# EAGLE design STK-681-332-E EvalBoard OwnRoutingStarted (EAGLE 9.3.1)

## Sheet 1 of 4: Supply, Reverse Voltage Protection, Power Indicators
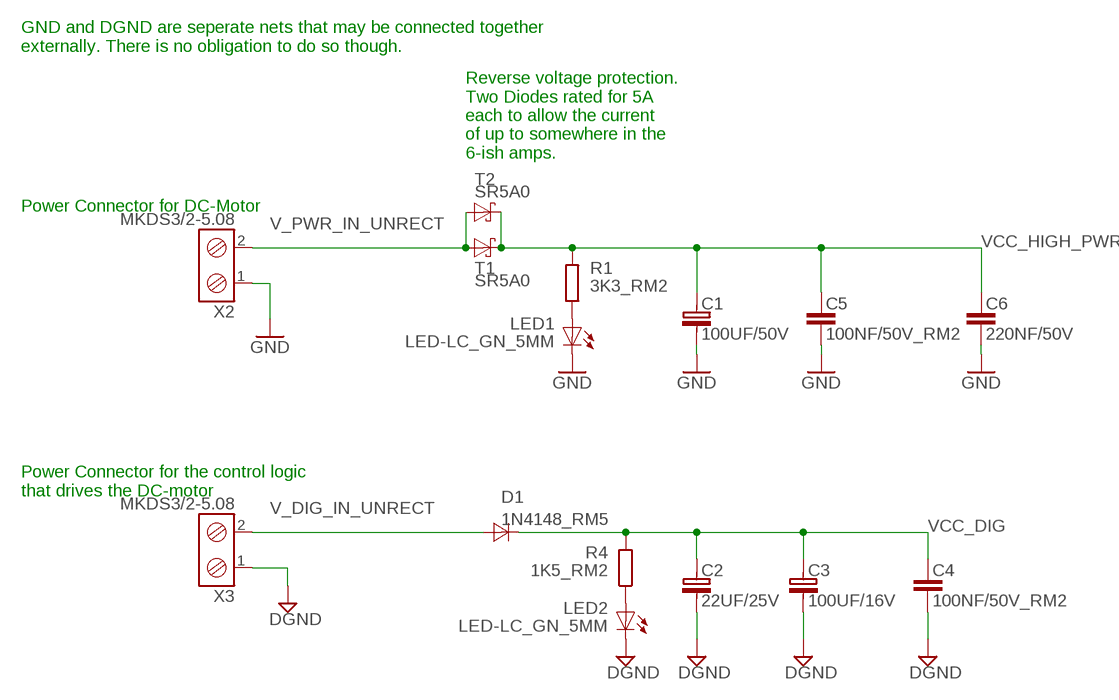
[diagram p0: schematic, sheet 1]

### Parts
C1  100UF/50V  [RM3,5D8]
C2  22UF/25V  [RM2D5]
C3  100UF/16V  [RM2,5D6]
C4  100NF/50V_RM2  [RM2.54]
C5  100NF/50V_RM2  [RM2.54]
C6  220NF/50V  [RM2.54]
D1  1N4148_RM5  [DO35_RM5.08]
LED1  LED-LC_GN_5MM  [LED5MM]
LED2  LED-LC_GN_5MM  [LED5MM]
R1  3K3_RM2  [RM2.54]
R4  1K5_RM2  [RM2.54]
T1  SR5A0  [DO201_RM10.16]
T2  SR5A0  [DO201_RM10.16]
X2  MKDS3/2-5.08  [MKDS3/2-5.08]
X3  MKDS3/2-5.08  [MKDS3/2-5.08]

### Nets
DGND: C2.- C3.- C4.2 LED2.K(C) X3.1 ; also sheet 2,3,4
GND: C1.- C5.2 C6.2 LED1.K(C) X2.1 ; also sheet 4
N$5: LED1.A R1.1
N$7: LED2.A R4.1
V_DIG_IN_UNRECT: D1.A X3.2
V_PWR_IN_UNRECT: T1.A T2.A X2.2
VCC_DIG: C2.+ C3.+ C4.1 D1.K R4.2 ; also sheet 2,3,4
VCC_HIGH_PWR: C1.+ C5.1 C6.1 R1.2 T1.K T2.K ; also sheet 4

### Notes on the sheet
- GND and DGND are seperate nets that may be connected together  
  externally. There is no obligation to do so though.
- Reverse voltage protection.
  Two Diodes rated for 5A
  each to allow the current 
  of up to somewhere in the 
  6-ish amps.
- Power Connector for DC-Motor
- Power Connector for the control logic
  that drives the DC-motor

## Sheet 2 of 4: Direction Signal Decoding, Brake
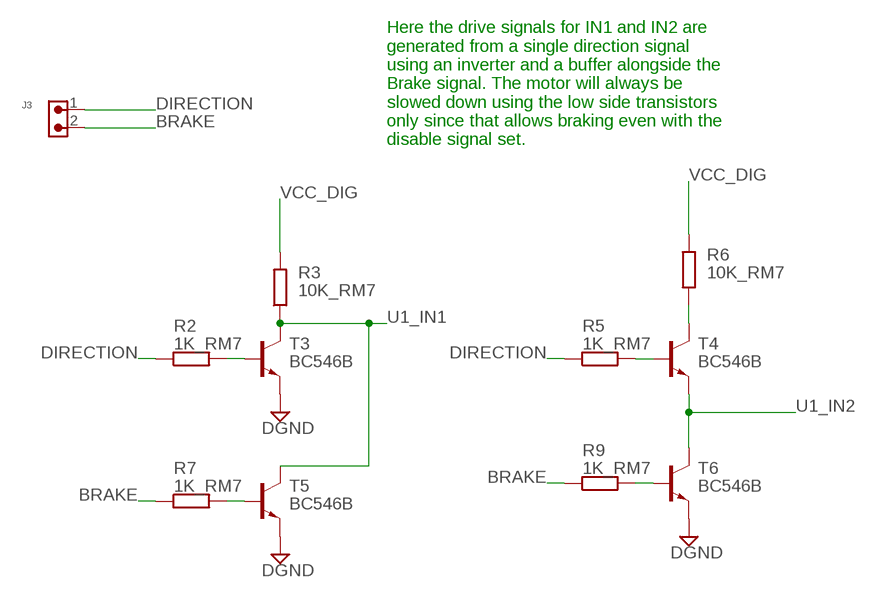
[diagram p1: schematic, sheet 2]

### Parts
J3  6130XX11121_61300211121  [61300211121]
R2  1K_RM7  [RM7.62]
R3  10K_RM7  [RM7.62]
R5  1K_RM7  [RM7.62]
R6  10K_RM7  [RM7.62]
R7  1K_RM7  [RM7.62]
R9  1K_RM7  [RM7.62]
T3  BC546B  [TO92]
T4  BC546B  [TO92]
T5  BC546B  [TO92]
T6  BC546B  [TO92]

### Nets
BRAKE: J3.2 R7.1 R9.1
DGND: T3.3(E) T5.3(E) T6.3(E) ; also sheet 1,3,4
DIRECTION: J3.1 R2.1 R5.1
N$3: R2.2 T3.2(B)
N$4: R5.2 T4.2(B)
N$6: R6.1 T4.1(C)
N$8: R7.2 T5.2(B)
N$9: R9.2 T6.2(B)
U1_IN1: R3.1 T3.1(C) T5.1(C) ; also sheet 4
U1_IN2: T4.3(E) T6.1(C) ; also sheet 4
VCC_DIG: R3.2 R6.2 ; also sheet 1,3,4

### Notes on the sheet
- Here the drive signals for IN1 and IN2 are
  generated from a single direction signal 
  using an inverter and a buffer alongside the 
  Brake signal. The motor will always be
  slowed down using the low side transistors
  only since that allows braking even with the
  disable signal set.

## Sheet 3 of 4: Disable and PWM
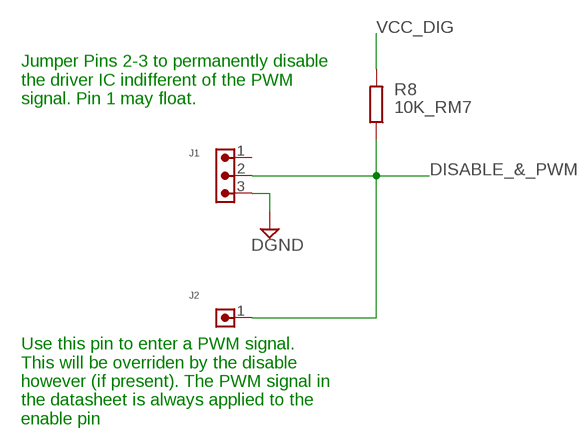
[diagram p2: schematic, sheet 3]

### Parts
J1  6130XX11121_61300311121  [61300311121]
J2  6130XX11121_61300111121  [61300111121]
R8  10K_RM7  [RM7.62]

### Nets
DGND: J1.3 ; also sheet 1,2,4
DISABLE_&_PWM: J1.2 J2.1 R8.1 ; also sheet 4
VCC_DIG: R8.2 ; also sheet 1,2,4
Unconnected: J1.1

### Notes on the sheet
- Jumper Pins 2-3 to permanently disable 
  the driver IC indifferent of the PWM 
  signal. Pin 1 may float.
- Use this pin to enter a PWM signal.
  This will be overriden by the disable 
  however (if present). The PWM signal in
  the datasheet is always applied to the 
  enable pin

## Sheet 4 of 4: Hook up of the actual IC itself
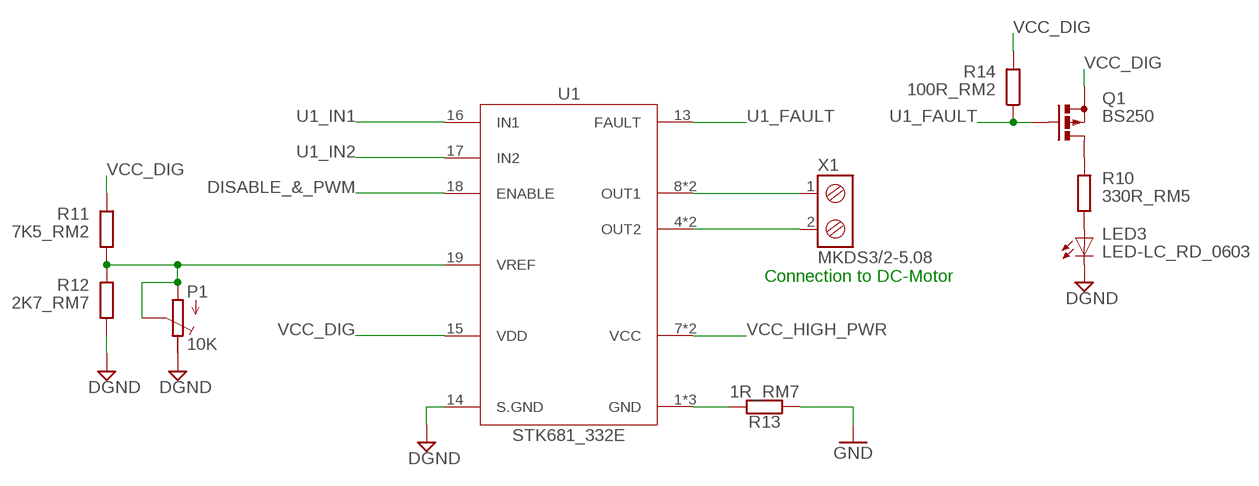
[diagram p3: schematic, sheet 4]

### Parts
LED3  LED-LC_RD_0603  [0603]
P1  10K  [R_TRIMM]
Q1  BS250  [SOT54E]
R10  330R_RM5  [RM5.08]
R11  7K5_RM2  [RM2.54]
R12  2K7_RM7  [RM7.62]
R13  1R_RM7  [RM7.62]
R14  100R_RM2  [RM2.54]
U1  STK681_332E  [SIP19]
X1  MKDS3/2-5.08  [MKDS3/2-5.08]

### Nets
DGND: LED3.K(C) P1.3(E) R12.1 U1.14(S.GND) ; also sheet 1,2,3
DISABLE_&_PWM: U1.18(ENABLE) ; also sheet 3
GND: R13.1 ; also sheet 1
N$1: U1.8(OUT1) U1.10(OUT1) X1.1
N$2: U1.4(OUT2) U1.6(OUT2) X1.2
N$10: LED3.A R10.1
N$11: Q1.D R10.2
N$12: R13.2 U1.1(GND) U1.2(GND) U1.3(GND)
N$13: P1.1(A) P1.2(S) R11.1 R12.2 U1.19(VREF)
U1_FAULT: Q1.G R14.1 U1.13(FAULT)
U1_IN1: U1.16(IN1) ; also sheet 2
U1_IN2: U1.17(IN2) ; also sheet 2
VCC_DIG: Q1.S R11.2 R14.2 U1.15(VDD) ; also sheet 1,2,3
VCC_HIGH_PWR: U1.7(VCC) U1.9(VCC) ; also sheet 1
Unconnected: U1.5(NC) U1.11(NC) U1.12(NC)

### Notes on the sheet
- Connection to DC-Motor

## Library data of the parts
C1 = ELKO_THD:100UF/50V: 100µF/50V LowESR-Elko, THD; ID: EKO-ELT-0002; REICHELT: RAD FR 100/50; TYPE: THD
C2 = ELKO_THD:22UF/25V: 22µF/25V LowESR-Elko, THD; ID: EKO-ELT-0004; REICHELT: RAD FC 22/25; TYPE: THD
C3 = ELKO_THD:100UF/16V: 100µF/16V LowESR-Elko, THD; ID: EKO-ELT-0001; REICHELT: RAD FC 100/16; TYPE: THD
C4 C5 = Kondensator_Keramik_THD:100NF/50V: 100nF/50V X7R-Kondensator, THD; ID: EKO-KET-0001; REICHELT: X7R-2,5 100N; TYPE: THD
C6 = Kondensator_Keramik_THD:220NF/50V: 220nF/50V Z5U-Kondensator, THD; ID: EKO-KET-0010; REICHELT: Z5U-2,5 220N; TYPE: THD
D1 = Diode:1N4148: 1N4148 (Kleinsignaldiode); ID: EHL-DIO-0001; REICHELT: 1N 4148; TYPE: THD
J1 = Wurth_Connectors_WR-PHD:6130XX11121_61300311121: WR-PHD 2.54 mm THT Pin Header ARTICLE PROPERTIES: Pins:1;​ 2;​ 3;​ 4;​ 5;​ 6;​ 7;​ 8;​ 9;​ 10;​ 12;​ 13;​ 14;​ 15;​ 16;​ 18;​ 20;​ 22;​ 24;​ 25;​ 32;​ 36;​ 40 KIND PROPERTIES: Pitch：2.54 mm Quality Class:3 as per CECC 75 301-802 Rows：Single Gender：Pin Header Type：Straight MATERIAL PROPERTIES: Insulator Material :PBT Insulator Flammability Rating:UL94 V-0 Contact Material:Copper Alloy Contact Plating:Gold Contact Type:Stamped GENERAL INFORMATION Operating Temperature:-40 up to +105 °C Compliance:RoHS ELECTRICAL PROPERTIES: Rated Current:3 A IR 1:3 A Withstanding Voltage:500 V (AC) Contact Resistance:20 mΩ RISO:1000 MΩ CERTIFICATION UL Approval:E323964 PACKAGING PROPERTIES Packaging:Bag <https://katalog.we-online.com/media/images/v2/o33211v209%20Family_BTB_PHD_6130xx11121.jpg> Details see: https://katalog.we-online.com/en/em/PHD_2_54_THT_PIN_HEADER_6130XX11121 Updated by Yingchun,Shan 2019-10-16 2019 (C) Würth Elektronik; DATASHEET-URL: https://katalog.we-online.com/em/datasheet/61300311121.pdf; GENDER: Pin Header; IR: 3A; MATES: WR-PHD 2.54mm Angled Socket Header /SMT Socket Header/Socket Header; PACKAGING: Bag; PART-NUMBER: 61300311121; PINS: 3; ROWS: Single; TYPE: Straight
J2 = Wurth_Connectors_WR-PHD:6130XX11121_61300111121: WR-PHD 2.54 mm THT Pin Header ARTICLE PROPERTIES: Pins:1;​ 2;​ 3;​ 4;​ 5;​ 6;​ 7;​ 8;​ 9;​ 10;​ 12;​ 13;​ 14;​ 15;​ 16;​ 18;​ 20;​ 22;​ 24;​ 25;​ 32;​ 36;​ 40 KIND PROPERTIES: Pitch：2.54 mm Quality Class:3 as per CECC 75 301-802 Rows：Single Gender：Pin Header Type：Straight MATERIAL PROPERTIES: Insulator Material :PBT Insulator Flammability Rating:UL94 V-0 Contact Material:Copper Alloy Contact Plating:Gold Contact Type:Stamped GENERAL INFORMATION Operating Temperature:-40 up to +105 °C Compliance:RoHS ELECTRICAL PROPERTIES: Rated Current:3 A IR 1:3 A Withstanding Voltage:500 V (AC) Contact Resistance:20 mΩ RISO:1000 MΩ CERTIFICATION UL Approval:E323964 PACKAGING PROPERTIES Packaging:Bag <https://katalog.we-online.com/media/images/v2/o33211v209%20Family_BTB_PHD_6130xx11121.jpg> Details see: https://katalog.we-online.com/en/em/PHD_2_54_THT_PIN_HEADER_6130XX11121 Updated by Yingchun,Shan 2019-10-16 2019 (C) Würth Elektronik; DATASHEET-URL: https://katalog.we-online.com/em/datasheet/61300111121.pdf; GENDER: Pin Header; IR: 3A; MATES: WR-PHD 2.54mm Angled Socket Header /SMT Socket Header/Socket Header; PACKAGING: Bag; PART-NUMBER: 61300111121; PINS: 1; ROWS: Single; TYPE: Straight
J3 = Wurth_Connectors_WR-PHD:6130XX11121_61300211121: WR-PHD 2.54 mm THT Pin Header ARTICLE PROPERTIES: Pins:1;​ 2;​ 3;​ 4;​ 5;​ 6;​ 7;​ 8;​ 9;​ 10;​ 12;​ 13;​ 14;​ 15;​ 16;​ 18;​ 20;​ 22;​ 24;​ 25;​ 32;​ 36;​ 40 KIND PROPERTIES: Pitch：2.54 mm Quality Class:3 as per CECC 75 301-802 Rows：Single Gender：Pin Header Type：Straight MATERIAL PROPERTIES: Insulator Material :PBT Insulator Flammability Rating:UL94 V-0 Contact Material:Copper Alloy Contact Plating:Gold Contact Type:Stamped GENERAL INFORMATION Operating Temperature:-40 up to +105 °C Compliance:RoHS ELECTRICAL PROPERTIES: Rated Current:3 A IR 1:3 A Withstanding Voltage:500 V (AC) Contact Resistance:20 mΩ RISO:1000 MΩ CERTIFICATION UL Approval:E323964 PACKAGING PROPERTIES Packaging:Bag <https://katalog.we-online.com/media/images/v2/o33211v209%20Family_BTB_PHD_6130xx11121.jpg> Details see: https://katalog.we-online.com/en/em/PHD_2_54_THT_PIN_HEADER_6130XX11121 Updated by Yingchun,Shan 2019-10-16 2019 (C) Würth Elektronik; DATASHEET-URL: https://katalog.we-online.com/em/datasheet/61300211121.pdf; GENDER: Pin Header; IR: 3A; MATES: WR-PHD 2.54mm Angled Socket Header /SMT Socket Header/Socket Header; PACKAGING: Bag; PART-NUMBER: 61300211121; PINS: 2; ROWS: Single; TYPE: Straight
LED1 LED2 = Optisch:LED-LC_GN: Low-current-LED grün; ID: EOP-LED-0001; REICHELT: LED 5MM 2MA GN; TYPE: THD
LED3 = Optisch:LED-LC_RD: Low-Current-LED rot; ID: EOP-LED-0007; REICHELT: OSO LSL29K-G1J2; TYPE: SMD
P1 = Widerstand_var:10K: 10kΩ Trimmer; ID: EWI-POT-0001; REICHELT: 64W-10K; TYPE: THD
Q1 = transistor-small-signal:BS250: P-CHANNEL MOS FET
R1 = Widerstand_0207:3K3: 3,3kΩ Widerstand, THD 0207; ID: EWI-THD-3301; REICHELT: METALL 3,30K; TYPE: THD
R2 R5 R7 R9 = Widerstand_0207:1K: 1kΩ Widerstand, THD 0207; ID: EWI-THD-1001; REICHELT: METALL 1,00K; TYPE: THD
R3 R6 R8 = Widerstand_0207:10K: 10kΩ Widerstand, THD 0207; ID: EWI-THD-1002; REICHELT: METALL 10,0K; TYPE: THD
R4 = Widerstand_0207:1K5: 1,5kΩ Widerstand, THD 0207; ID: EWI-THD-1501; REICHELT: METALL 1,50K; TYPE: THD
R10 = Widerstand_0207:330R: 330Ω Widerstand, THD 0207; ID: EWI-THD-3300; REICHELT: METALL 330; TYPE: THD
R11 = Widerstand_0207:7K5: 7,5kΩ Widerstand, THD 0207; ID: EWI-THD-7501; REICHELT: METALL 7,50K; TYPE: THD
R12 = Widerstand_0207:2K7: 2,7kΩ Widerstand, THD 0207; ID: EWI-THD-2701; REICHELT: METALL 2,70K; TYPE: THD
R13 = Widerstand_0207:1R: 1Ω Widerstand, THD 0207; ID: EWI-THD-1008; REICHELT: METALL 1,00; TYPE: THD
R14 = Widerstand_0207:100R: 100Ω Widerstand, THD 0207; ID: EWI-THD-1000; REICHELT: METALL 100; TYPE: THD
T1 T2 = Diode:SR5A0: SR5A0 (Schottky-Diode); ID: EHL-DIO-0003; REICHELT: SB 5100; TYPE: THD
T3-T6 = Transistor:BC546B: BC546 (NPN-Transistor); ID: EHL-TRA-0001; REICHELT: BC 546B; TYPE: THD
U1 = Analog:STK681_332E: STK681-332-E (DC Motor Driver); FARNELL: 2217062; ID: EIC-ANA-0014; MOUSER: 863-STK681-332-E; TYPE: THD
X1-X3 = Klemmen:MKDS3/2-5.08: Schraubklemme 2-fach, Liftsystem RM 5,08; FARNELL: 3041165; ID: EKL-PCB-0004; TYPE: THD

## Board
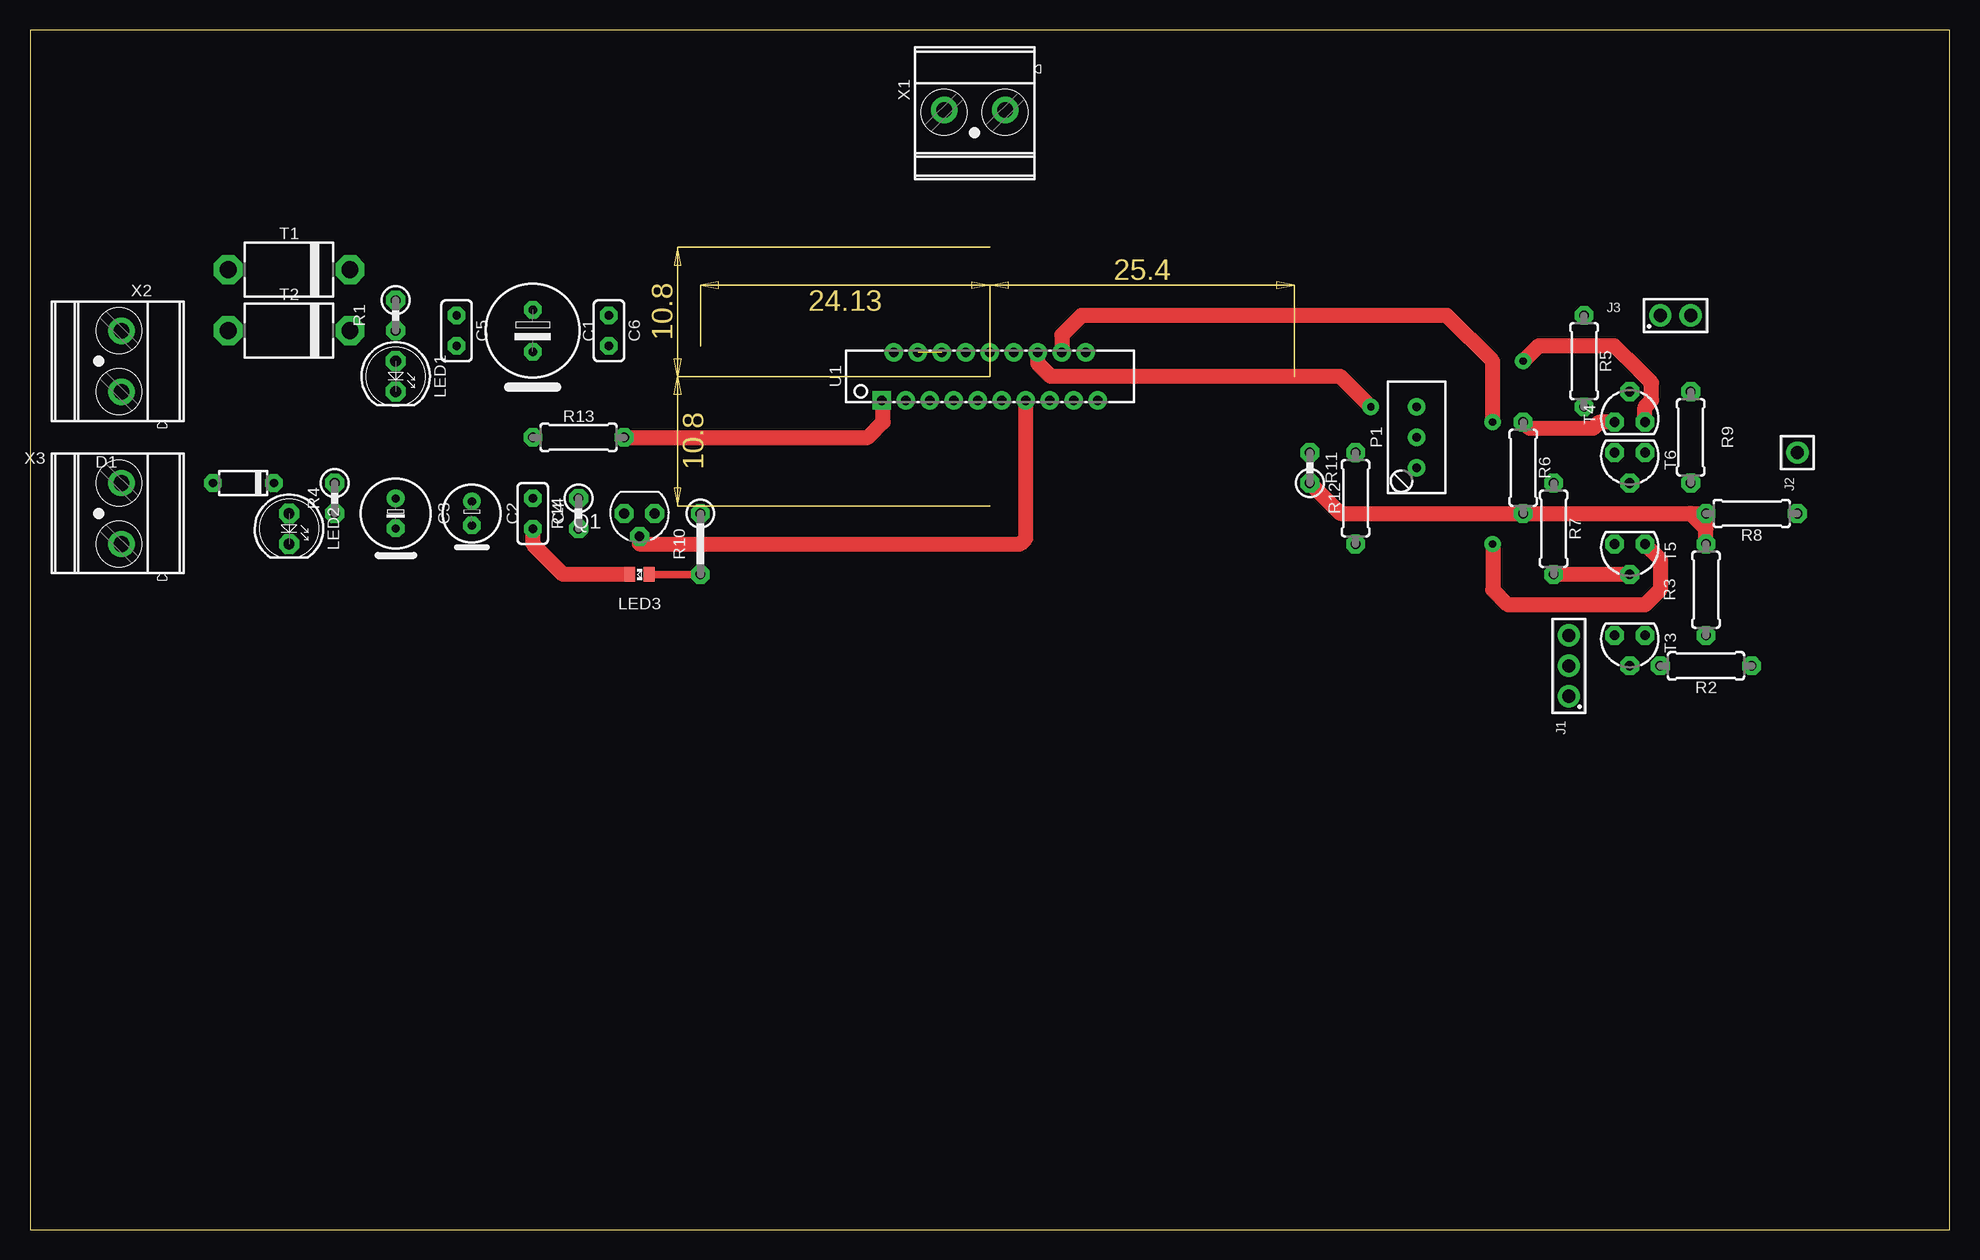
[diagram p4: board, top side]
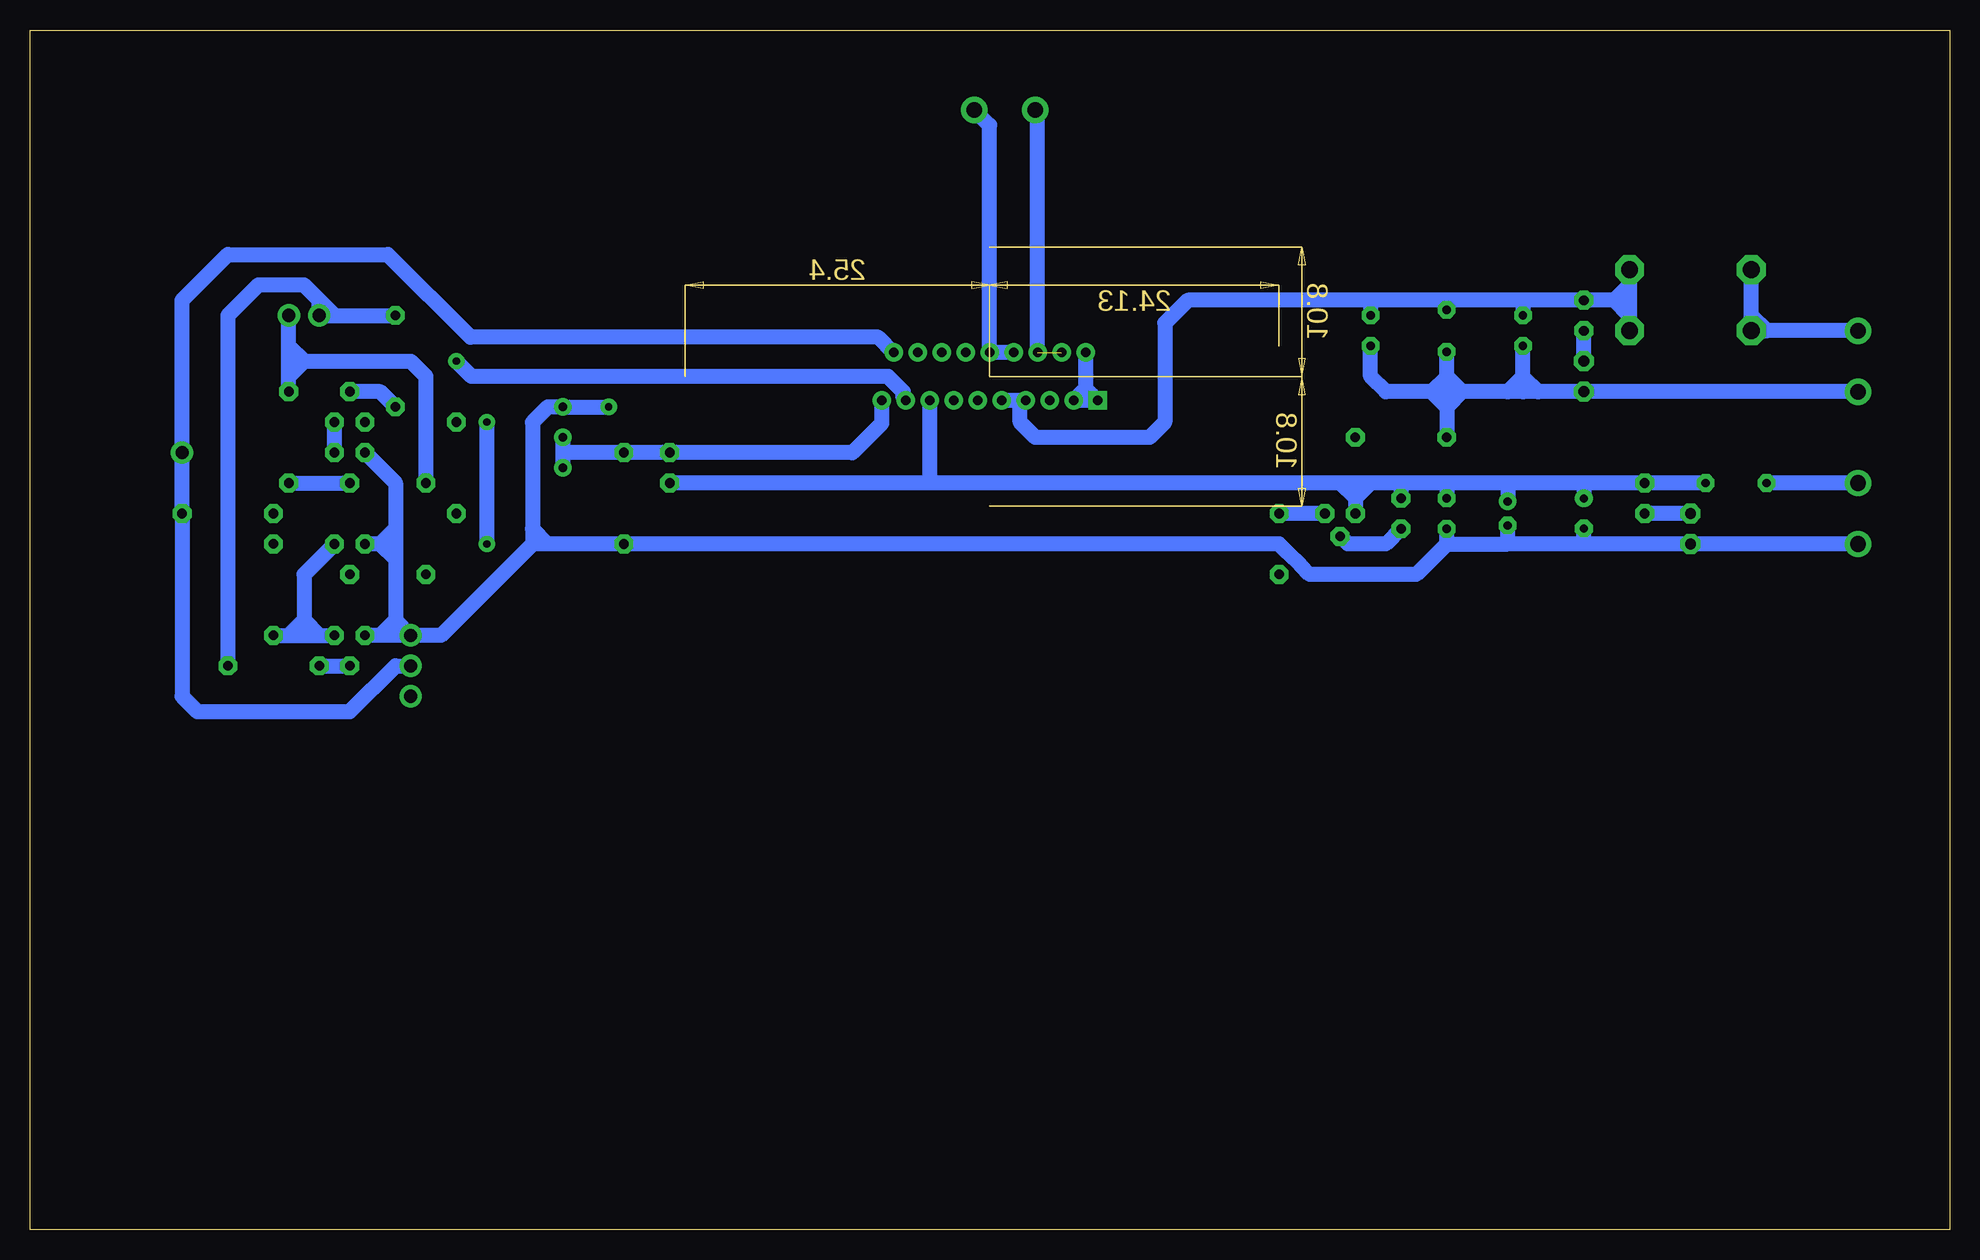
[diagram p5: board, bottom side, seen from below]

Size 160 x 100 mm. Coordinates in mm from the lower left corner, seen from the top.
Outline: 0,0 160,0 160,100 0,100 0,0
Copper layers (1*16): Top 0.035mm / dielectric 1.5mm / Bottom 0.035mm
Design rules "2LayersINT": minimum track width 0.3mm, minimum drill 0.6mm, track to track 15mil, track to pad 15mil, pad to pad 15mil, via to via 15mil, smd to smd 15mil, copper to edge 15mil, drill to drill 0.5mm, minimum pad ring 15mil, minimum via ring 15mil, stop-mask expansion 0mil, vias tented up to drill 100mm, thermal gap 15mil

### Footprints (pad centres in the part's own frame; a part is rotated, then mirrored left to right if it is on the bottom)
RM3,5D8 = drill 0.7 pad 1.3 octagon: + -1.75,0; - 1.75,0
RM2D5 = drill 0.7 pad 1.3: + -1,0 | drill 0.7 pad 1.3 octagon: - 1,0
RM2,5D6 = drill 0.7 pad 1.3: + -1.25,0 | drill 0.7 pad 1.3 octagon: - 1.25,0
RM2.54 = drill 0.7 pad 1.3 octagon: 1 -1.27,0; 2 1.27,0
DO35_RM5.08 = drill 0.7 pad 1.3 octagon: A -2.54,0; K 2.54,0
61300311121 = drill 1.1: 1 -2.54,0; 2 0,0; 3 2.54,0
61300111121 = drill 1.1: 1 0,0
61300211121 = drill 1.1: 1 -1.27,0; 2 1.27,0
LED5MM = drill 0.9 pad 1.5 octagon: A -1.27,0; K 1.27,0
0603 = smd 0.9 x 1.2: A -0.8,0; K 0.8,0
R_TRIMM = drill 0.7 pad 1.3: 1 -2.54,0; 2 0,0; 3 2.54,0
SOT54E = drill 0.813 octagon: D -1.27,0; G 0,1.905; S 1.27,0
RM2.54' = drill 0.8 pad 1.4 octagon: 1 -1.27,0; 2 1.27,0
RM7.62 = drill 0.8 pad 1.4 octagon: 1 -3.81,0; 2 3.81,0
RM5.08 = drill 0.8 pad 1.4 octagon: 1 -2.54,0; 2 2.54,0
DO201_RM10.16 = drill 1.4 pad 2.4 octagon: A -5.08,0; K 5.08,0
TO92 = drill 0.8 pad 1.4 octagon: 1 0,1.27; 2 2.54,0; 3 0,-1.27
SIP19 = drill 0.8 pad 1.4 square: 1 -9,-2 | drill 0.8 pad 1.4: 2 -8,2; 3 -7,-2; 4 -6,2; 5 -5,-2; 6 -4,2; 7 -3,-2; 8 -2,2; 9 -1,-2; 10 0,2; 11 1,-2; 12 2,2; 13 3,-2; 14 4,2; 15 5,-2; 16 6,2; 17 7,-2; 18 8,2; 19 9,-2
MKDS3/2-5.08 = drill 1.3 pad 2.2: 1 -2.54,0; 2 2.54,0

### Placement (x,y rotation side)
C1  41.91,74.93 270 top
C2  36.83,59.69 270 top
C3  30.48,59.69 270 top
C4  41.91,59.69 270 top
C5  35.56,74.93 270 top
C6  48.26,74.93 270 top
D1  17.78,62.23 0 top
J1  128.27,46.99 90 top
J2  147.32,64.77 90 top
J3  137.16,76.2 0 top
LED1  30.48,71.12 270 top
LED2  21.59,58.42 270 top
LED3  50.8,54.61 180 top
P1  115.57,66.04 90 top
Q1  50.8,59.69 180 top
R1  3K3_RM2  [RM2.54']  30.48,76.2 90 top
R2  139.7,46.99 180 top
R3  139.7,53.34 90 top
R4  1K5_RM2  [RM2.54']  25.4,60.96 90 top
R5  129.54,72.39 270 top
R6  124.46,63.5 270 top
R7  127,58.42 270 top
R8  143.51,59.69 180 top
R9  138.43,66.04 270 top
R10  55.88,57.15 90 top
R11  7K5_RM2  [RM2.54']  106.68,63.5 270 top
R12  110.49,60.96 90 top
R13  45.72,66.04 0 top
R14  100R_RM2  [RM2.54']  45.72,59.69 90 top
T1  21.59,80.01 0 top
T2  21.59,74.93 0 top
T3  133.35,49.53 270 top
T4  133.35,67.31 90 top
T5  133.35,57.15 270 top
T6  133.35,64.77 270 top
U1  80.01,71.12 0 top
X1  78.74,93.34 180 top
X2  7.62,72.39 90 top
X3  7.62,59.69 90 top

### Tracks (layer width: path | path; a pad name or v marks a point on that pad's centre or on a via)
BRAKE
  Bottom 1.27: R7.1 127,71.12 128.27,72.39 137.16,72.39 | 137.16,72.39 138.43,73.66 J3.2 138.43,71.12 | R9.1 138.43,71.12 | 138.43,71.12 137.16,72.39
DGND  (via drill 0.6)
  Top 0.635: LED3.K 49.53,54.61
  Top 1.27: C4.2 41.91,57.15 44.45,54.61 49.53,54.61 | v111.76,68.58 109.22,71.12 85.09,71.12 84.01,72.2 U1.14
  Bottom 1.27: X3.1 LED2.K 30.48,57.15 | 30.48,57.15 C3.- | 36.83,57.15 C2.- | 41.91,57.15 36.83,57.15 | 41.91,57.15 C4.2 | 41.91,57.15 44.45,54.61 53.34,54.61 54.08,55.35 55.14,56.41 55.88,57.15 R12.1 116.84,57.15 | T6.3 129.54,62.23 129.54,58.42 | 129.54,57.15 130.81,57.15 | 130.81,57.15 T5.3 | 129.54,58.42 129.54,57.15 | J1.3 129.54,49.53 | 129.54,49.53 130.81,49.53 | 130.81,49.53 T3.3 | 118.11,57.15 125.73,49.53 J1.3 | 116.84,57.15 118.11,57.15 | 129.54,57.15 129.54,55.88 | 129.54,55.88 129.54,50.8 | 129.54,50.8 129.54,49.53 | 129.54,58.42 130.81,57.15 | 130.81,57.15 129.54,55.88 | J1.3 129.54,50.8 | 129.54,50.8 130.81,49.53 | 118.11,58.42 118.11,67.31 116.84,68.58 P1.3 v111.76,68.58 | 118.11,58.42 118.11,57.15 | 116.84,57.15 118.11,58.42 | 30.48,57.15 36.83,57.15
DIRECTION
  Bottom 1.27: 134.62,76.2 J3.1 135.89,77.47 | 134.62,76.2 R5.1 | 135.89,77.47 137.16,78.74 140.97,78.74 143.51,76.2 R2.1 | 134.62,76.2 135.89,77.47
DISABLE_&_PWM
  Bottom 1.27: J1.2 129.54,46.99 133.35,43.18 146.05,43.18 147.32,44.45 R8.1 J2.1 147.32,77.47 143.51,81.28 130.18,81.28 123.28,74.39 89.28,74.39 U1.18
GND
  Bottom 1.27: X2.1 LED1.K 34.29,69.85 | 34.29,69.85 35.56,69.85 | 35.56,69.85 35.56,71.12 | 35.56,71.12 C5.2 | 35.56,69.85 36.83,69.85 | 36.83,69.85 40.64,69.85 | 40.64,69.85 41.91,69.85 | 41.91,69.85 41.91,71.12 | 41.91,71.12 C1.- | 36.83,69.85 35.56,71.12 | 35.56,71.12 34.29,69.85 | 41.91,69.85 43.18,69.85 | 43.18,69.85 46.99,69.85 48.26,71.12 C6.2 | 43.18,69.85 41.91,71.12 | 41.91,71.12 40.64,69.85 | 41.91,69.85 41.91,68.58 | 41.91,68.58 R13.1 | 40.64,69.85 41.91,68.58 | 41.91,68.58 43.18,69.85
N$1
  Bottom 1.27: U1.8 U1.10 80.01,92.08 X1.1
N$2  (1 unrouted)
  Bottom 1.27: U1.6 76.01,93.16 X1.2
N$3
  Bottom 1.27: R2.2 T3.2
N$4
  Bottom 1.27: R5.2 130.81,69.85 T4.2
N$5
  Bottom 1.27: LED1.A R1.1
N$6
  Top 1.27: T4.1 130.81,67.31 130.28,66.78 124.99,66.78 R6.1
N$7
  Bottom 1.27: LED2.A R4.1
N$8
  Top 1.27: T5.2 R7.2
N$9
  Bottom 1.27: R9.2 T6.2
N$10
  Top 0.635: LED3.A R10.1
N$11
  Bottom 1.27: Q1.D R10.2
N$12
  Top 1.27: R13.2 69.85,66.04 71.12,67.31 71.12,69.01 U1.1
  Bottom 1.27: 72.39,69.12 U1.1 72.01,70.12 | 72.39,69.12 U1.3 72.01,70.12 | 72.01,70.12 72.01,69.5 72.39,69.12 | U1.2 72.01,70.12
N$13
  Bottom 1.27: P1.1 115.57,64.77 | 115.57,64.77 P1.2 | 115.57,64.77 R12.2 R11.1 91.44,64.77 89.01,67.2 U1.19
U1_FAULT
  Top 1.27: Q1.G 50.8,57.15 82.55,57.15 83.01,57.61 U1.13
  Bottom 1.27: R14.1 46.99,57.15 50.16,57.15 Q1.G
U1_IN1  (via drill 0.6)
  Top 1.27: T5.1 135.89,55.88 135.89,53.34 134.62,52.07 123.19,52.07 121.92,53.34 v121.92,57.15 | v121.92,67.31 121.92,72.39 118.11,76.2 87.63,76.2 86.01,74.58 U1.16
  Bottom 1.27: T5.1 137.16,54.61 137.16,50.8 | R3.1 138.43,49.53 | 138.43,49.53 137.16,49.53 | 137.16,49.53 135.89,49.53 | 135.89,49.53 T3.1 | v121.92,67.31 v121.92,57.15 | 137.16,50.8 137.16,49.53 | 137.16,50.8 135.89,49.53 | 137.16,50.8 138.43,49.53
U1_IN2  (via drill 0.6)
  Top 1.27: T4.3 134.62,68.58 135.15,69.11 135.15,70.59 134.09,71.65 132.08,73.66 125.73,73.66 v124.46,72.39
  Bottom 1.27: T6.1 T4.3 | v124.46,72.39 123.19,71.12 88.47,71.12 87.21,69.86 87.21,69.32 U1.17
V_DIG_IN_UNRECT
  Bottom 1.27: X3.2 D1.A
V_PWR_IN_UNRECT
  Bottom 1.27: X2.2 15.24,74.93 | 15.24,74.93 T2.A 16.51,76.2 | 16.51,76.2 T1.A | 15.24,74.93 16.51,76.2
VCC_DIG
  Top 1.27: 138.43,59.69 R6.2 109.22,59.69 R11.2 | 138.43,59.69 R8.2 139.7,58.42 | R3.2 139.7,58.42 | 139.7,58.42 138.43,59.69
  Bottom 1.27: D1.K R4.2 30.48,62.23 | 30.48,62.23 C3.+ | 36.83,62.23 C2.+ | 36.83,62.23 41.91,62.23 | 41.91,62.23 C4.1 | 41.91,62.23 45.72,62.23 | 45.72,62.23 R14.2 | 45.72,62.23 48.26,62.23 | 48.26,62.23 49.53,62.23 | 49.53,62.23 49.53,60.96 | 49.53,60.96 Q1.S | 49.53,62.23 50.8,62.23 | 49.53,60.96 48.26,62.23 | 49.53,60.96 50.8,62.23 | 30.48,62.23 36.83,62.23 | 50.8,62.23 85.09,62.23 | 85.09,62.23 R11.2 | 85.09,62.23 85.01,62.31 U1.15
VCC_HIGH_PWR
  Bottom 1.27: T1.K 26.67,78.74 | 26.67,78.74 26.67,76.2 | 26.67,76.2 T2.K | 26.67,76.2 27.94,77.47 | 27.94,77.47 R1.2 35.56,77.47 | 27.94,77.47 26.67,78.74 | 35.56,77.47 C5.1 | 35.56,77.47 41.91,77.47 | 41.91,77.47 C1.+ | 41.91,77.47 48.26,77.47 | 48.26,77.47 C6.1 | 48.26,77.47 63.5,77.47 65.41,75.56 65.41,67.31 66.67,66.04 76.2,66.04 77.47,67.31 77.47,68.66 U1.7 U1.9